# EAGLE schematic PoPP_RevP1 (EAGLE 7.6.0)
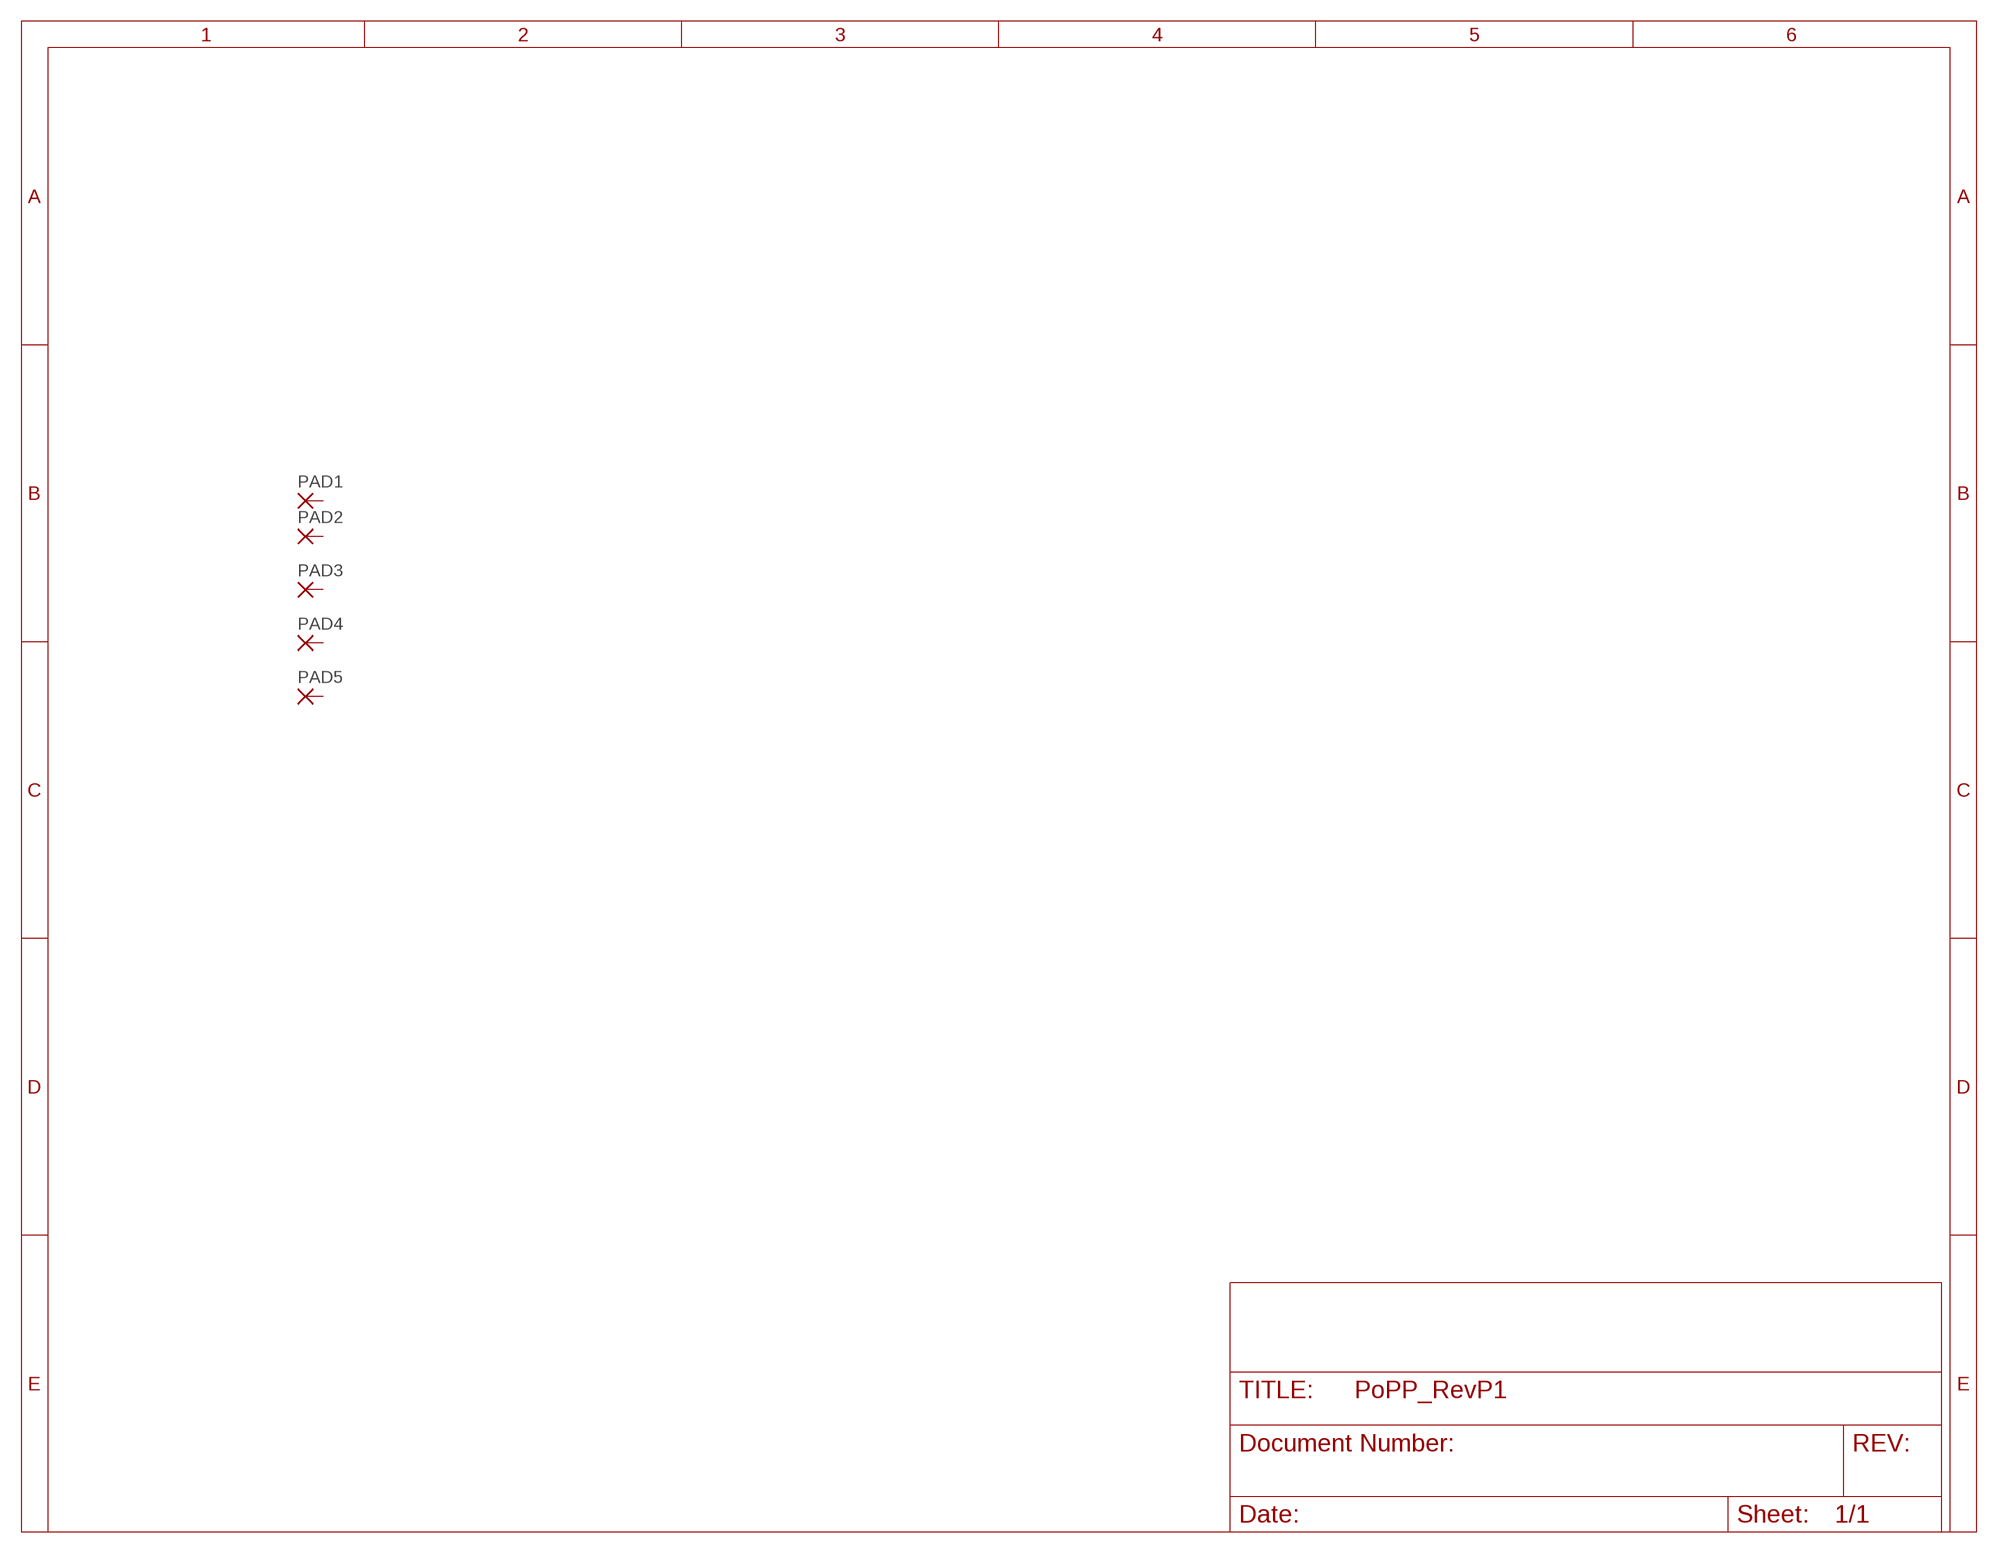
[diagram p0: schematic, sheet 1]

## Parts
PAD1  SMD2  [SMD1,27-2,54]
PAD2  SMD2  [SMD1,27-2,54]
PAD3  SMD2  [SMD1,27-2,54]
PAD4  SMD2  [SMD1,27-2,54]
PAD5  SMD2  [SMD1,27-2,54]
Unconnected: PAD1.1(P) PAD2.1(P) PAD3.1(P) PAD4.1(P) PAD5.1(P)

## Library data of the parts
PAD1-PAD5 = wirepad:SMD2: SMD PAD